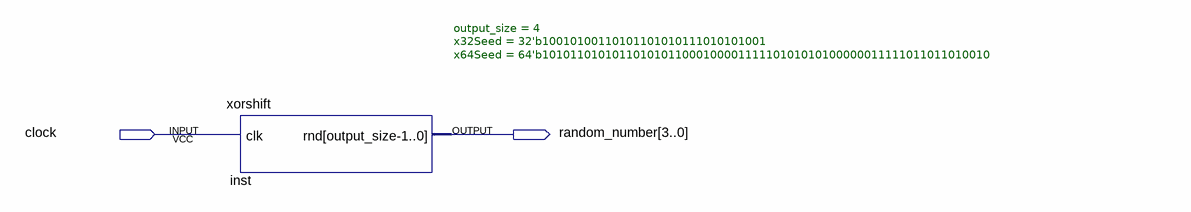
[diagram p0: schematic sheet]
// Quartus schematic xorshift_test.bdf as structural Verilog: 1 symbols, 2 pins
module xorshift_test (
  input  clock,
  output [3:0] random_number
);

  xorshift #(.output_size(4), .x32Seed(32'b10010100110101101010111010101001), .x64Seed(64'b1010110101011010101100010000111110101010100000011111011011010010)) inst (
    .clk(clock), .rnd(random_number));
endmodule
